# Altium schematic sheet cpu_board.SchDoc
size A3
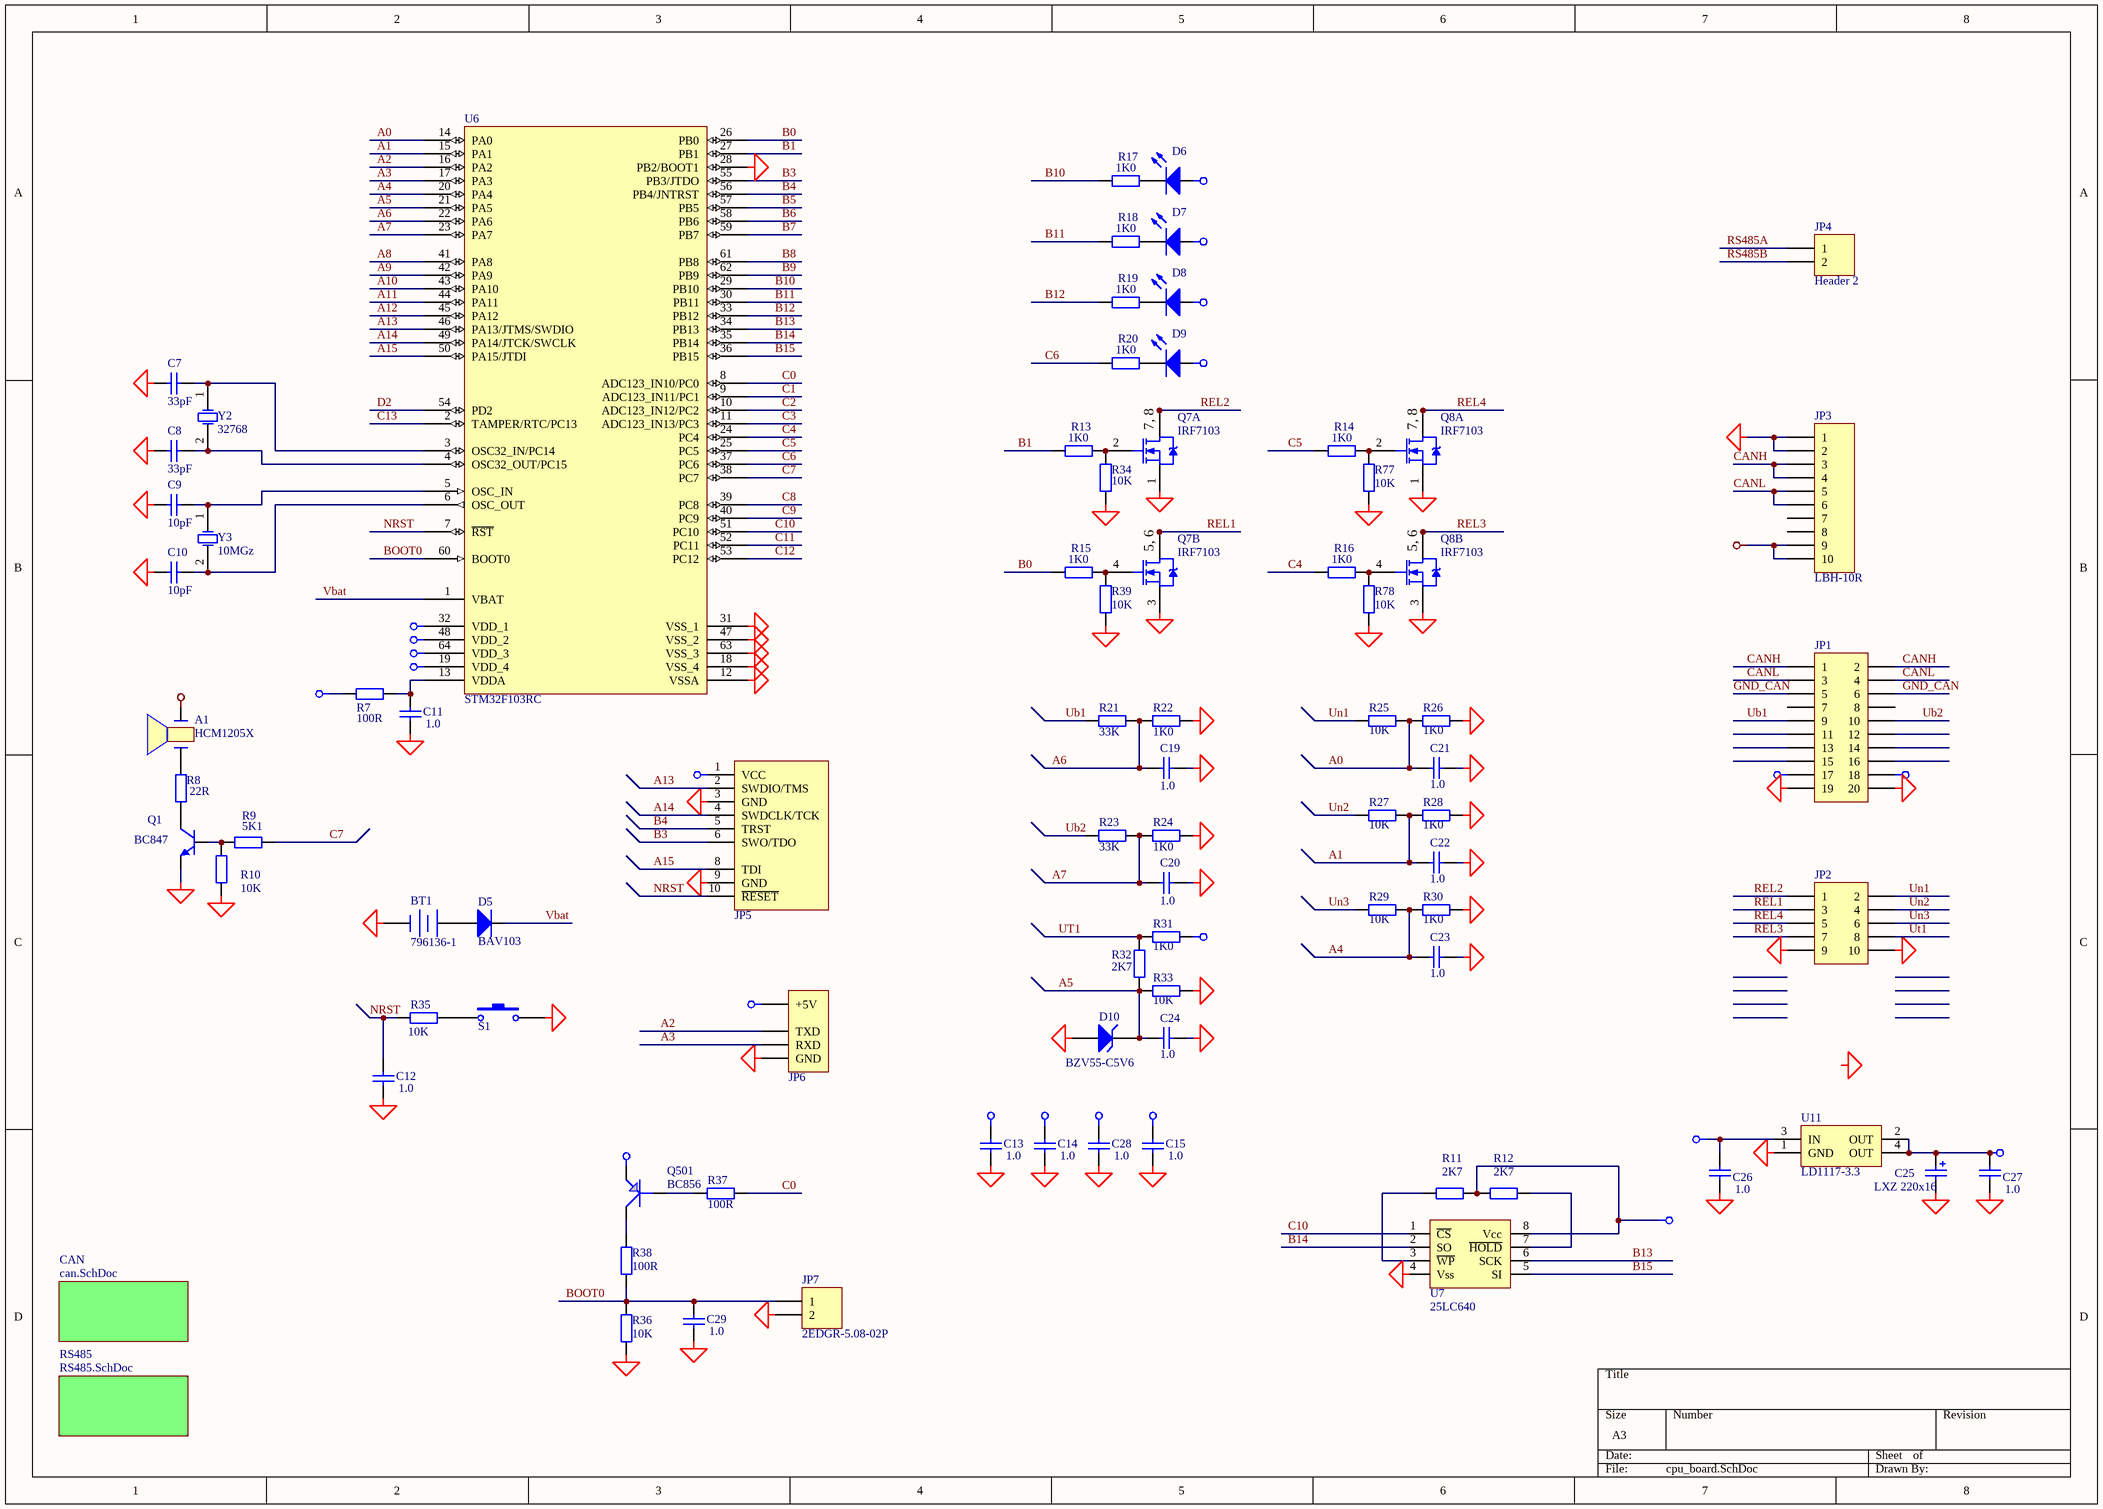
[diagram p0: cpu_board.SchDoc]

## Parts
A1  HCM1205X  [zumm]
BT1  796136-1  [BAT_HOLD_SMD]
C7  33pF  [_1206]
C8  33pF  [_1206]
C9  10pF  [_1206]
C10  10pF  [_1206]
C11  1.0  [_1206]
C12  1.0  [_1206]
C13  1.0  [_1206]
C14  1.0  [_1206]
C15  1.0  [_1206]
C19  1.0  [_1206]
C20  1.0  [_1206]
C21  1.0  [_1206]
C22  1.0  [_1206]
C23  1.0  [_1206]
C24  1.0  [_1206]
C25  LXZ 220x16  [el3]
C26  1.0  [_1206]
C27  1.0  [_1206]
C28  1.0  [_1206]
C29  1.0  [_1206]
D5  BAV103  [_1206d]
D6  LED0  [el3]  (value not drawn)
D7  LED0  [el3]  (value not drawn)
D8  LED0  [el3]  (value not drawn)
D9  LED0  [el3]  (value not drawn)
D10  BZV55-C5V6  [_1206d]
JP1  PBD-10  [HDR2X10]  (value not drawn)
JP2  PBD-10  [HDR2X5]  (value not drawn)
JP3  LBH-10R  [SCM-10MR]
JP4  Header 2  [2EDGR-5.0-2P]
JP5  CORTEX_DEBUG_CONNECTOR_PAL  [CORTEX_DEBUG_CONNECTOR]  (value not drawn)
JP6  UART_PORT  [HDR1X5_uart]  (value not drawn)
JP7  2EDGR-5.08-02P  [HDR1X2]
Q1  BC847  [SO-G3]
Q7  IRF7103  [SO-G8/Y2.2]  (parts A,B of 2)
Q8  IRF7103  [SO-G8/Y2.2]  (parts A,B of 2)
Q501  BC856  [SO-G3]
R7  100R  [_1206]
R8  22R  [_1206]
R9  5K1  [_1206]
R10  10K  [_1206]
R11  2K7  [_1206]
R12  2K7  [_1206]
R13  1K0  [_1206]
R14  1K0  [_1206]
R15  1K0  [_1206]
R16  1K0  [_1206]
R17  1K0  [_1206]
R18  1K0  [_1206]
R19  1K0  [_1206]
R20  1K0  [_1206]
R21  33K  [_1206]
R22  1K0  [_1206]
R23  33K  [_1206]
R24  1K0  [_1206]
R25  10K  [_1206]
R26  1K0  [_1206]
R27  10K  [_1206]
R28  1K0  [_1206]
R29  10K  [_1206]
R30  1K0  [_1206]
R31  1K0  [_1206]
R32  2K7  [_1206]
R33  10K  [_1206]
R34  10K  [_1206]
R35  10K  [_1206]
R36  10K  [_1206]
R37  100R  [_1206]
R38  100R  [_1206]
R39  10K  [_1206]
R77  10K  [_1206]
R78  10K  [_1206]
S1  SWT-3  [SWT-6R]  (value not drawn)
U6  STM32F103RC  [F-QFP10X10-G64/N]
U7  25LC640  [SO-G8/D5]
U11  LD1117-3.3  [DSO-G3]
Y2  32768  [QWARZ2]
Y3  10MGz  [QWARZ1]

## Sub-sheets
CAN = can.SchDoc: no entries
RS485 = RS485.SchDoc: no entries

## Nets
+3v3: C14.2 C25.1 C27.2 C28.2 D6.1(A) D7.1(A) D8.1(A) D9.1(A) JP5.1(VCC) Q501.2(E) R7.1 U6.19(VDD_4) U6.32(VDD_1) U6.48(VDD_2) U6.64(VDD_3) U11.2(OUT) U11.4(OUT)
+5v: A1.1 C13.2 C15.2 C26.2 JP1.17 JP1.18 JP3.9 JP3.10 JP6.1(+5V) R11.2 R12.1 R31.2 U7.8(Vcc) U11.3(IN)
GND: BT1.2(-) C7.1 C8.1 C9.1 C10.1 C11.1 C12.1 C13.1 C14.1 C15.1 C19.2 C20.2 C21.2 C22.2 C23.2 C24.2 C25.2 C26.1 C27.1 C28.1 C29.1 D10.1(A) JP1.19 JP1.20 JP2.9 JP2.10 JP3.1 JP3.2 JP5.3(GND) JP5.9(GND) JP7.2 Q1.2(E) Q7.1(S) Q7.3(S) Q8.1(S) Q8.3(S) R10.2 R22.2 R24.2 R26.2 R28.2 R30.2 R33.1 R34.1 R36.1 R39.1 R77.1 R78.1 S1.1 U6.12(VSSA) U6.18(VSS_4) U6.28(PB2/BOOT1) U6.31(VSS_1) U6.47(VSS_2) U6.63(VSS_3) U7.4(Vss) U11.1(GND)
SGND: JP6.5(GND)
A0: C21.1 R25.1 R26.1 U6.14(PA0)
A1: C22.1 R27.1 R28.1 U6.15(PA1)
A2: JP6.3(TXD) U6.16(PA2)
A3: JP6.4(RXD) U6.17(PA3)
A4: C23.1 R29.1 R30.1 U6.20(PA4)
A5: C24.1 D10.2(K) R32.2 R33.2 U6.21(PA5)
A6: C19.1 R21.1 R22.1 U6.22(PA6)
A7: C20.1 R23.1 R24.1 U6.23(PA7)
A8: U6.41(PA8)
A9: U6.42(PA9)
A10: U6.43(PA10)
A11: U6.44(PA11)
A12: U6.45(PA12)
A13: JP5.2(SWDIO/TMS) U6.46(PA13/JTMS/SWDIO)
A14: JP5.4(SWDCLK/TCK) U6.49(PA14/JTCK/SWCLK)
A15: JP5.8(TDI) U6.50(PA15/JTDI)
B0: R15.1 U6.26(PB0)
B1: R13.1 U6.27(PB1)
B3: JP5.6(SWO/TDO) U6.55(PB3/JTDO)
B4: JP5.5(TRST) U6.56(PB4/JNTRST)
B5: U6.57(PB5)
B6: U6.58(PB6)
B7: U6.59(PB7)
B8: U6.61(PB8)
B9: U6.62(PB9)
B10: R17.1 U6.29(PB10)
B11: R18.1 U6.30(PB11)
B12: R19.1 U6.33(PB12)
B13: U6.34(PB13) U7.6(SCK)
B14: U6.35(PB14) U7.2(SO)
B15: U6.36(PB15) U7.5(SI)
BOOT0: C29.2 JP7.1 R36.2 R38.1 U6.60(BOOT0)
C0: R37.1 U6.8(ADC123_IN10/PC0)
C1: U6.9(ADC123_IN11/PC1)
C2: U6.10(ADC123_IN12/PC2)
C3: U6.11(ADC123_IN13/PC3)
C4: R16.1 U6.24(PC4)
C5: R14.1 U6.25(PC5)
C6: R20.1 U6.37(PC6)
C7: R9.2 U6.38(PC7)
C8: U6.39(PC8)
C9: U6.40(PC9)
C10: U6.51(PC10) U7.1(~{CS})
C11: U6.52(PC11)
C12: U6.53(PC12)
C13: U6.2(TAMPER/RTC/PC13)
CANH: JP1.1 JP1.2 JP3.3 JP3.4
CANL: JP1.3 JP1.4 JP3.5 JP3.6
D2: U6.54(PD2)
GND_CAN: JP1.5 JP1.6
NRST: C12.2 JP5.10(~{RESET}) R35.1 U6.7(~{RST})
REL1: JP2.3 Q7.5(D) Q7.6(D)
REL2: JP2.1 Q7.7(D) Q7.8(D)
REL3: JP2.7 Q8.5(D) Q8.6(D)
REL4: JP2.5 Q8.7(D) Q8.8(D)
RS485A: JP4.1
RS485B: JP4.2
Ub1: JP1.9 R21.2
Ub2: JP1.10 R23.2
Un1: JP2.2 R25.2
Un2: JP2.4 R27.2
Un3: JP2.6 R29.2
Ut1: JP2.8 R31.1 R32.1
Vbat: D5.2(K) U6.1(VBAT)
NetA1_2: A1.2 R8.1
NetBT1_1: BT1.1(+) D5.1(A)
NetC7_2: C7.2 U6.3(OSC32_IN/PC14) Y2.1(OSC1)
NetC8_2: C8.2 U6.4(OSC32_OUT/PC15) Y2.2(OSC2)
NetC9_2: C9.2 U6.5(OSC_IN) Y3.1(OSC1)
NetC10_2: C10.2 U6.6(OSC_OUT) Y3.2(OSC2)
NetC11_2: C11.2 R7.2 U6.13(VDDA)
NetD6_2: D6.2(K) R17.2
NetD7_2: D7.2(K) R18.2
NetD8_2: D8.2(K) R19.2
NetD9_2: D9.2(K) R20.2
NetQ1_1: Q1.1(B) R9.1 R10.1
NetQ1_3: Q1.3(C) R8.2
NetQ7_2: Q7.2(G) R13.2 R34.2
NetQ7_4: Q7.4(G) R15.2 R39.2
NetQ8_2: Q8.2(G) R14.2 R77.2
NetQ8_4: Q8.4(G) R16.2 R78.2
NetQ501_1: Q501.1(B) R37.2
NetQ501_3: Q501.3(C) R38.2
NetR11_1: R11.1 U7.3(~{WP})
NetR12_2: R12.2 U7.7(~{HOLD})
NetR35_2: R35.2 S1.2

Not connected (* = marked no-connect by the designer): JP1 7 8 11 12 13 14 15 16; JP3 7 8

## Notes on the sheet
- Labels drawn without touching a wire or pin: GND
- (in symbol IRF7301, part A) 7, 8
- (in symbol IRF7301, part B) 5, 6

## Library data of the parts
A1 = PJEZ0: Beeper; Value: EFM260
BT1 = Battery: Multicell Battery; Manufacturer: Generic Components; Published: 24-Mar-1999; Revision: July-2002: Re-released for DXP Platform.; Publisher: Altium Limited
C7 C8 = Cap Semi: Capacitor (Semiconductor SIM Model); Manufacturer: Generic Components; Class I: Passive; Value: 15pF; Published: 8-Jun-2000; Revision: July-2002: Re-released for DXP Platform.; Publisher: Altium Limited; Class II: Capacitor
C9 C10 = Cap Semi: Capacitor; Manufacturer: Generic Components; Class I: Passive; Value: 15pF; Published: 8-Jun-2000; Revision: July-2002: Re-released for DXP Platform.; Publisher: Altium Limited; Class II: Capacitor
C11-C15 C26-C29 = Cap Semi: Capacitor; Manufacturer: Generic Components; Class I: Passive; Value: 0,1; Published: 8-Jun-2000; Revision: July-2002: Re-released for DXP Platform.; Publisher: Altium Limited; Class II: Capacitor
C19-C24 = Cap Semi: Capacitor; Manufacturer: Generic Components; Class I: Passive; Value: 1,0; Published: 8-Jun-2000; Revision: July-2002: Re-released for DXP Platform.; Publisher: Altium Limited; Class II: Capacitor
C25 = Cap Pol1: Polarized Capacitor (Radial); Manufacturer: Generic Components; Class I: Passive; Value: 22,0x50; Published: 8-Jun-2000; Revision: July-2002: Re-released for DXP Platform.; Publisher: Altium Limited; Class II: Capacitor
D5 = Diode: Default Diode; Manufacturer: Generic Components; Class I: Discrete; Class II: Diode - Switching; Published: 8-Jun-2000; Revision: July-2002: Re-released for DXP Platform.; Publisher: Altium Limited
D6-D9 = LED0: Typical INFRARED GaAs LED; Manufacturer: Generic Components; Class I: Optoelectronic; Published: 8-Jun-2000; Revision: July-2002: Re-released for DXP Platform.; Publisher: Altium Limited; Class II: LED
D10 = D Zener: Zener Diode; Manufacturer: Generic Components; Class I: Discrete; Class II: Diode - Zener; Value: BZV55C5V6; Published: 8-Jun-2000; Revision: July-2002: Re-released for DXP Platform.; Publisher: Altium Limited
JP1 = Header 10X2: Header, 10-Pin, Dual row; Manufacturer: Generic Components; Class I: Connector; Revision: July-2002: Re-released for DXP Platform.; Publisher: Altium Limited
JP2 = Header 5X2: Header, 5-Pin, Dual row; Manufacturer: Generic Components; Class I: Connector; Revision: July-2002: Re-released for DXP Platform.; Publisher: Altium Limited
JP3 = Header 10: Header, 10-Pin; Manufacturer: Generic Components; Class I: Connector; Revision: July-2002: Re-released for DXP Platform.; Publisher: Altium Limited
JP4 JP7 = Header 2: Header, 2-Pin; Manufacturer: Generic Components; Class I: Connector; Revision: July-2002: Re-released for DXP Platform.; Publisher: Altium Limited
JP6 = UART_PORT: Header, 5-Pin; Manufacturer: Generic Components; Class I: Connector; Revision: July-2002: Re-released for DXP Platform.; Publisher: Altium Limited
Q1 = BC847ALT1: General Purpose Transistor NPN Silicon; Manufacturer: Motorola; Package Information: Latest Revision: 1997; Class I: Discrete; Class II: BJT - Low Power; Published: 29-Sep-2000; Revision: July-2002: Re-released for DXP Platform.; Datasheet: Latest Revision: 1997; Package Reference: 318-08; Publisher: Altium Limited
Q7 Q8 = IRF7301: FET; Manufacturer: International Rectifier; Revision 1: 29-Sep-2000: Re-orientated a 'Drain' pin on first part.; Revision 2: July-2002: Re-released for DXP Platform.; Class I: Discrete; Class II: MOSFET - Power; Published: 8-Jun-2000; Datasheet: Latest Revision: Aug-1997; Package Reference: SOIC8; Publisher: Altium Limited; Value: IRF7103
Q501 = GT109: Bipolar transistor; Right: 20; Bottom: 20; Value: BC856
R7 R9 = Res2: Resistor; Manufacturer: Generic Components; Class I: Passive; Value: 1K; Published: 8-Jun-2000; Revision: July-2002: Re-released for DXP Platform.; Publisher: Altium Limited; Class II: Resistor
R8 = Res2: Resistor; Manufacturer: Generic Components; Class I: Passive; Value: 10R; Published: 8-Jun-2000; Revision: July-2002: Re-released for DXP Platform.; Publisher: Altium Limited; Class II: Resistor
R10 = Res2: Resistor; Manufacturer: Generic Components; Class I: Passive; Published: 8-Jun-2000; Revision: July-2002: Re-released for DXP Platform.; Publisher: Altium Limited; Class II: Resistor; Value: 10K
R11-R34 R39 R77 R78 = Res2: Resistor; Manufacturer: Generic Components; Class I: Passive; Rule: Undefined; Published: 8-Jun-2000; Revision: July-2002: Re-released for DXP Platform.; Publisher: Altium Limited; Class II: Resistor
  R11 R12 R32: Value: 2K7
  R13-R20 R22 R24 R26 R28 R30 R31: Value: 1K0
  R21 R23: Value: 33K
  R25 R27 R29 R33 R34 R39 R77 R78: Value: 10K
R35-R38 = RES: Resistor; Manufacturer: Generic Components; Class I: Passive; Value: 1K; Published: 8-Jun-2000; Revision: July-2002: Re-released for DXP Platform.; Publisher: Altium Limited; Class II: Resistor
S1 = SWT-6: Switch; Manufacturer: Generic Components; Published: 24-Mar-1999; Revision: July-2002: Re-released for DXP Platform.; Publisher: Altium Limited
U6 = STM32F103RC: STM32 ARM-based 32-bit MCU with 64 Kbytes Flash, 64-pin LQFP, Industrial Temperature; Published: *; DatasheetVersion: *; PackageVersion: *; PackageReference: *; Publisher: *; PackageDescription: *; ComponentLink1Description: *; ComponentLink1URL: *; ComponentLink2Description: *; ComponentLink2URL: *
U7 = 25LC640: Memory; Value: 26LC640
U11 = REG1117-3.3: 800mA and 1A Low Dropout Positive Regulator 2.85V, 3.3V, 5V, and Adjustable; Manufacturer: Burr-Brown; Package Information: Latest Revision: Rev. C; Class I: Power Management; Class II: Voltage Regulator; Published: 8-Jun-2000; Revision: July-2002: Re-released for DXP Platform.; Datasheet: Latest Revision: Sep-1997; Package Reference: ZZ311; Publisher: Altium Limited
Y2 Y3 = XTAL: Crystal Oscillator; Manufacturer: Generic Components; Published: 8-Jun-2000; Revision: July-2002: Re-released for DXP Platform.; Publisher: Altium Limited; Class I: Oscillator; Class II: Crystal Oscillator
  Y3: Value: 10MGz